# Altium schematic sheet RF-UNIT-SPLIT.SCHDOC: RF-UNIT BIG
size A4; DocumentNumber: 12; Revision: 2.0; SheetNumber: 12; SheetTotal: 18
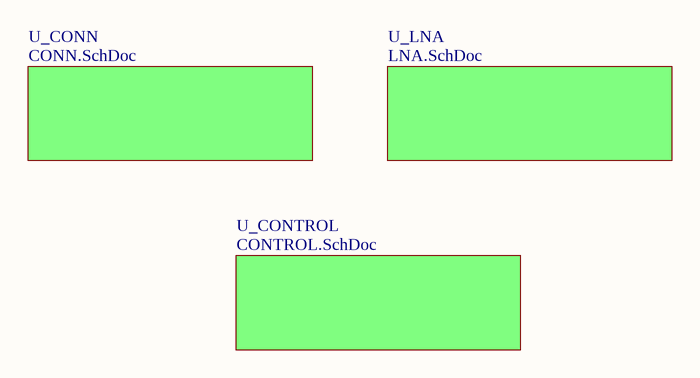
[diagram p0: RF-UNIT-SPLIT.SCHDOC]

## Sub-sheets
U_CONN = CONN.SchDoc: no entries
U_CONTROL = CONTROL.SchDoc: no entries
U_LNA = LNA.SchDoc: no entries

## Notes on the sheet
- Title
- Size:
- Date:
- A4
- Number:
- Time:
- Revision:
- Sheet
- of
- File: